# EAGLE design RPiDuino_revA (EAGLE 6.4)
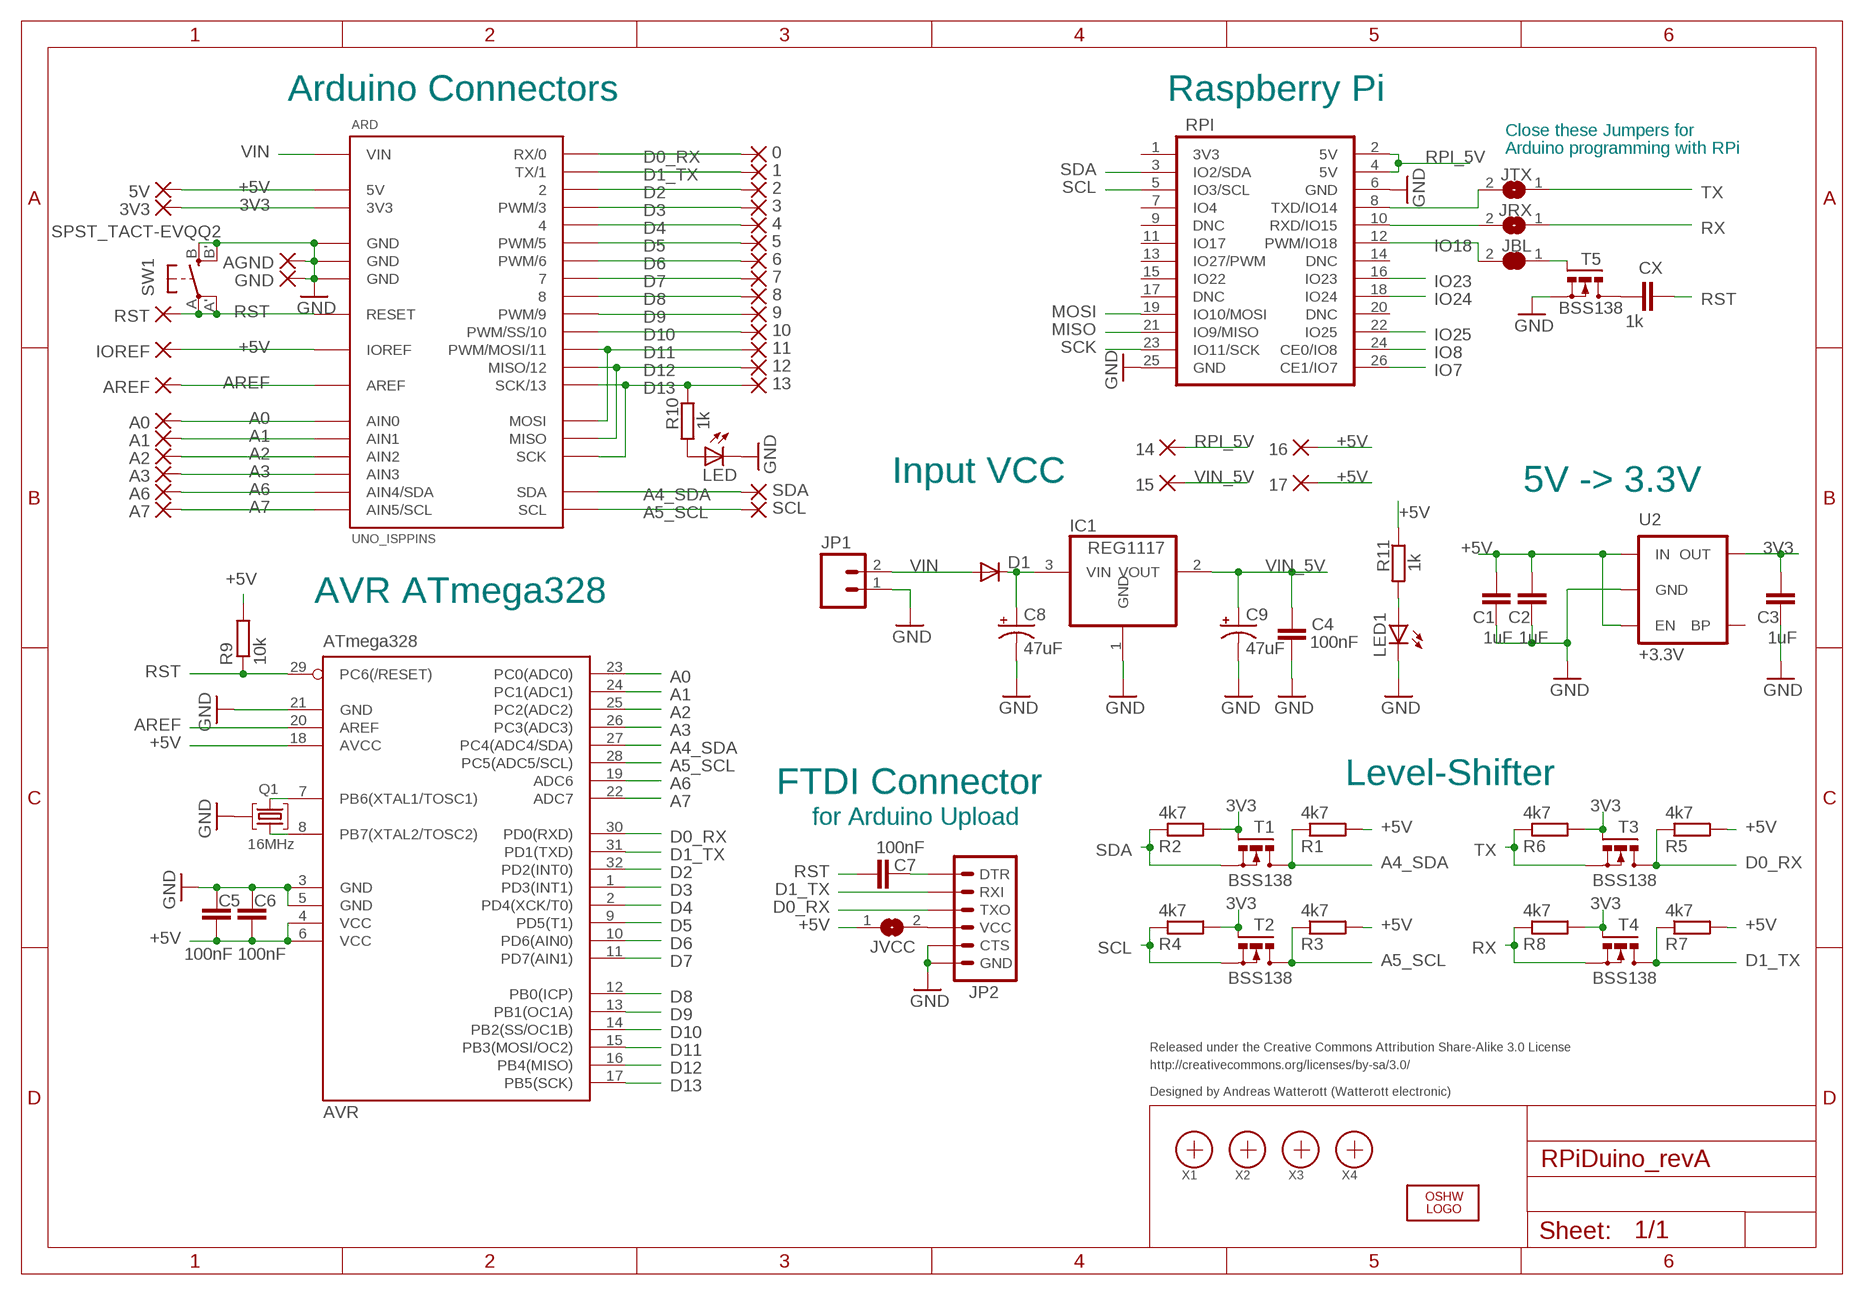
[diagram p0: schematic, sheet 1]

## Parts
0  WIREPAD1,6/0,9  [1,6/0,9]
1  WIREPAD1,6/0,9  [1,6/0,9]
2  WIREPAD1,6/0,9  [1,6/0,9]
3  WIREPAD1,6/0,9  [1,6/0,9]
3V3  WIREPAD1,6/0,9  [1,6/0,9]
4  WIREPAD1,6/0,9  [1,6/0,9]
5  WIREPAD1,6/0,9  [1,6/0,9]
5V  WIREPAD1,6/0,9  [1,6/0,9]
6  WIREPAD1,6/0,9  [1,6/0,9]
7  WIREPAD1,6/0,9  [1,6/0,9]
8  WIREPAD1,6/0,9  [1,6/0,9]
9  WIREPAD1,6/0,9  [1,6/0,9]
10  WIREPAD1,6/0,9  [1,6/0,9]
11  WIREPAD1,6/0,9  [1,6/0,9]
12  WIREPAD1,6/0,9  [1,6/0,9]
13  WIREPAD1,6/0,9  [1,6/0,9]
14  WIREPAD1,6/0,9  [1,6/0,9]
15  WIREPAD1,6/0,9  [1,6/0,9]
16  WIREPAD1,6/0,9  [1,6/0,9]
17  WIREPAD1,6/0,9  [1,6/0,9]
A0  WIREPAD1,6/0,9  [1,6/0,9]
A1  WIREPAD1,6/0,9  [1,6/0,9]
A2  WIREPAD1,6/0,9  [1,6/0,9]
A3  WIREPAD1,6/0,9  [1,6/0,9]
A6  WIREPAD1,6/0,9  [1,6/0,9]
A7  WIREPAD1,6/0,9  [1,6/0,9]
AGND  WIREPAD1,6/0,9  [1,6/0,9]
ARD  UNO_ISPPINS  [UNO_ISP3]
AREF  WIREPAD1,6/0,9  [1,6/0,9]
AVR  ATmega328  MEGA8-AI  [TQFP32-08]
C1  1uF  C-EUC0603  [C0603]
C2  1uF  C-EUC0603  [C0603]
C3  1uF  C-EUC0603  [C0603]
C4  100nF  C-EUC0603  [C0603]
C5  100nF  C-EUC0603  [C0603]
C6  100nF  C-EUC0603  [C0603]
C7  100nF  C-EUC0603  [C0603]
C8  47uF  CAP_POLD  [PANASONIC_D]
C9  47uF  CAP_POLD  [PANASONIC_D]
CX  1k  C-EUC0603  [C0603]
D1  DIODESMA  [SMA-DIODE]
GND  WIREPAD1,6/0,9  [1,6/0,9]
IC1  REG1117  [SOT223]
IOREF  WIREPAD1,6/0,9  [1,6/0,9]
JBL  SJ  [SJ]
JP1  M02PTH  [1X02]
JP2  ARDUINO_SERIAL_PROGRAMPTH  [1X06]
JRX  SJ  [SJ]
JTX  SJ  [SJ]
JVCC  SJ  [SJ]
LED  LEDCHIPLED_0603  [CHIPLED_0603]
LED1  LEDCHIPLED_0603  [CHIPLED_0603]
LOGO1  OSHW_LOGO_6MILX0150-NT  [OSHW_6X150_NOTEXT]
Q1  16MHz  SMD_OSC2  [SMD_OSC_35X15]
R1  4k7  R-EU_R0603  [R0603]
R2  4k7  R-EU_R0603  [R0603]
R3  4k7  R-EU_R0603  [R0603]
R4  4k7  R-EU_R0603  [R0603]
R5  4k7  R-EU_R0603  [R0603]
R6  4k7  R-EU_R0603  [R0603]
R7  4k7  R-EU_R0603  [R0603]
R8  4k7  R-EU_R0603  [R0603]
R9  10k  R-EU_R0603  [R0603]
R10  1k  R-EU_R0603  [R0603]
R11  1k  R-EU_R0603  [R0603]
RPI  RPI  [RPI]
RST  WIREPAD1,6/0,9  [1,6/0,9]
SCL  WIREPAD1,6/0,9  [1,6/0,9]
SDA  WIREPAD1,6/0,9  [1,6/0,9]
SW1  SPST_TACT-EVQQ2  [EVQ-Q2]
T1  BSS138  IRLML2502  [MICRO3]
T2  BSS138  IRLML2502  [MICRO3]
T3  BSS138  IRLML2502  [MICRO3]
T4  BSS138  IRLML2502  [MICRO3]
T5  BSS138  IRLML2502  [MICRO3]
U2  MIC52053.3V  [SOT23-5]
X1  PASSER  [PASSER]
X2  PASSER  [PASSER]
X3  PASSER  [PASSER]
X4  PASSER  [PASSER]

## Nets
3V3: 3V3.1(P) ARD.3V3 C3.1 R2.2 R4.2 R6.2 R8.2 T1.1(G) T2.1(G) T3.1(G) T4.1(G) U2.5(OUT)
+5V: 5V.1(P) 16.1(P) 17.1(P) ARD.5V ARD.IOREF AVR.4(VCC) AVR.6(VCC) AVR.18(AVCC) C1.1 C2.1 C5.1 C6.1 IOREF.1(P) JVCC.1 R1.2 R3.2 R5.2 R7.2 R9.2 R11.1 U2.1(IN) U2.3(EN)
A0: A0.1(P) ARD.AIN0 AVR.23(PC0(ADC0))
A1: A1.1(P) ARD.AIN1 AVR.24(PC1(ADC1))
A2: A2.1(P) ARD.AIN2 AVR.25(PC2(ADC2))
A3: A3.1(P) ARD.AIN3 AVR.26(PC3(ADC3))
A4_SDA: ARD.SDA AVR.27(PC4(ADC4/SDA)) R1.1 SDA.1(P) T1.3(D)
A5_SCL: ARD.SCL AVR.28(PC5(ADC5/SCL)) R3.1 SCL.1(P) T2.3(D)
A6: A6.1(P) ARD.AIN4(AIN4/SDA) AVR.19(ADC6)
A7: A7.1(P) ARD.AIN5(AIN5/SCL) AVR.22(ADC7)
AREF: ARD.AREF AREF.1(P) AVR.20(AREF)
D0_RX: 0.1(P) ARD.0(RX/0) AVR.30(PD0(RXD)) JP2.3(TXO) R5.1 T3.3(D)
D1_TX: 1.1(P) ARD.1(TX/1) AVR.31(PD1(TXD)) JP2.2(RXI) R7.1 T4.3(D)
D2: 2.1(P) ARD.2 AVR.32(PD2(INT0))
D3: 3.1(P) ARD.3(PWM/3) AVR.1(PD3(INT1))
D4: 4.1(P) ARD.4 AVR.2(PD4(XCK/T0))
D5: 5.1(P) ARD.5(PWM/5) AVR.9(PD5(T1))
D6: 6.1(P) ARD.6(PWM/6) AVR.10(PD6(AIN0))
D7: 7.1(P) ARD.7 AVR.11(PD7(AIN1))
D8: 8.1(P) ARD.8 AVR.12(PB0(ICP))
D9: 9.1(P) ARD.9(PWM/9) AVR.13(PB1(OC1A))
D10: 10.1(P) ARD.10(PWM/SS/10) AVR.14(PB2(SS/OC1B))
D11: 11.1(P) ARD.11(PWM/MOSI/11) ARD.MOSI AVR.15(PB3(MOSI/OC2))
D12: 12.1(P) ARD.12(MISO/12) ARD.MISO AVR.16(PB4(MISO))
D13: 13.1(P) ARD.13(SCK/13) ARD.SCK AVR.17(PB5(SCK)) R10.1
DTR: C7.1 JP2.1(DTR)
GND: AGND.1(P) ARD.GND@1(GND) ARD.GND@2(GND) ARD.GND@3(GND) AVR.3(GND) AVR.5(GND) AVR.21(GND) C1.2 C2.2 C3.2 C4.2 C5.2 C6.2 C8.- C9.- GND.1(P) IC1.1(GND) JP1.1 JP2.5(CTS) JP2.6(GND) LED1.C LED.C Q1.GND RPI.6(GND) RPI.25(GND) SW1.B'(S1) SW1.B(S) T5.2(S) U2.2(GND)
IO7: RPI.26(CE1/IO7)
IO8: RPI.24(CE0/IO8)
IO18: JBL.2 RPI.12(PWM/IO18)
IO23: RPI.16(IO23)
IO24: RPI.18(IO24)
IO25: RPI.22(IO25)
MISO: RPI.21(IO9/MISO)
MOSI: RPI.19(IO10/MOSI)
N$1: AVR.8(PB7(XTAL2/TOSC2)) Q1.2
N$2: AVR.7(PB6(XTAL1/TOSC1)) Q1.1
N$3: LED1.A R11.2
N$4: C8.+ D1.C IC1.3(VIN)
N$5: JP2.4(VCC) JVCC.2
N$11: CX.1 T5.3(D)
N$12: LED.A R10.2
RPI_5V: 14.1(P) RPI.2(5V) RPI.4(5V)
RPI_RST: JBL.1 T5.1(G)
RST: ARD.RST(RESET) AVR.29(PC6(/RESET)) C7.2 CX.2 R9.1 RST.1(P) SW1.A'(P1) SW1.A(P)
RX: JRX.1 R8.1 T4.2(S)
RX_IO15: JRX.2 RPI.10(RXD/IO15)
SCK: RPI.23(IO11/SCK)
SCL: R4.1 RPI.5(IO3/SCL) T2.2(S)
SDA: R2.1 RPI.3(IO2/SDA) T1.2(S)
TX: JTX.1 R6.1 T3.2(S)
TX_IO14: JTX.2 RPI.8(TXD/IO14)
VIN: ARD.VIN D1.A JP1.2
VIN_5V: 15.1(P) C4.1 C9.+ IC1.2(VOUT)
Unconnected: RPI.1(3V3) RPI.7(IO4) RPI.9(DNC) RPI.11(IO17) RPI.13(IO27/PWM) RPI.14(DNC) RPI.15(IO22) RPI.17(DNC) RPI.20(DNC) U2.4(BP)

## Notes on the sheet
- Arduino Connectors | Raspberry Pi
- Close these Jumpers for
- Arduino programming with RPi
- Input VCC | 5V -> 3.3V
- AVR ATmega328
- +3.3V
- FTDI Connector | Level-Shifter
- for Arduino Upload
- Released under the Creative Commons Attribution Share-Alike 3.0 License
- http://creativecommons.org/licenses/by-sa/3.0/
- Designed by Andreas Watterott (Watterott electronic)

## Library data of the parts
0 1-3 3V3 4 5 5V 6-17 A0 A1-A3 A6 A7 AGND AREF GND IOREF RST SCL SDA = wirepad:WIREPAD: Wire PAD connect wire on PCB
ARD = Arduino:UNO_ISP: Arduino UNO
AVR = atmel:MEGA8: MICROCONTROLLER 8 Kbytes FLASH, 1 kbytes SRAM, 512 bytes EEPROM, USART, 6-channel 10 bit ADC, 2-channel 8 bit ADC Pin compatible with Atmega48, ATMega88, ATMega168 Source: avr.lbr; MPN: ATMEGA8-16AU; OC_FARNELL: 9171371; OC_NEWARK: 73M8863
C1-C7 CX = rcl:C-EU: CAPACITOR, European symbol
C8 C9 = SparkFun-Capacitors:CAP_POL: Capacitor Polarized These are standard SMD and PTH capacitors. Normally 10uF, 47uF, and 100uF in electrolytic and tantalum varieties. Always verify the external diameter of the through hole cap, it varies with capacity, voltage, and manufacturer. The EIA devices should be standard.
D1 = SparkFun-DiscreteSemi:DIODE: Diode These are standard reverse protection diodes and small signal diodes. SMA package can handle up to about 1A. SOD-323 can handle about 200mA. What the SOD-323 package when ordering, there are some mfgs out there that are 5-pin packages.
IC1 = burr-brown:REG1117: 800mA and 1A Low Dropout (LDO) Positive Regulator 1.8V, 2.5V, 2.85V, 3.3V, 5V, and Adj; MPN: REG1117; OC_FARNELL: 1097566; OC_NEWARK: 14P6981
JBL JRX JTX JVCC = jumper:SJ: SMD solder JUMPER
JP1 = SparkFun-Connectors:M02: Header 2 Standard 2-pin 0.1" header. Use with straight break away headers (SKU : PRT-00116), right angle break away headers (PRT-00553), swiss pins (PRT-00743), machine pins (PRT-00117), and female headers (PRT-00115). Molex polarized connector foot print use with SKU : PRT-08233 with associated crimp pins and housings.
JP2 = SparkFun-Connectors:ARDUINO_SERIAL_PROGRAM: FTDI connector footprints
LED LED1 = led:LED: LED OSRAM: - CHIPLED LG R971, LG N971, LY N971, LG Q971, LY Q971, LO R971, LY R971 LH N974, LH R974 LS Q976, LO Q976, LY Q976 LO Q996 - Hyper CHIPLED LW Q18S LB Q993, LB Q99A, LB R99A - SideLED LS A670, LO A670, LY A670, LG A670, LP A670 LB A673, LV A673, LT A673, LW A673 LH A674 LY A675 LS A676, LA A676, LO A676, LY A676, LW A676 LS A679, LY A679, LG A679 - Hyper Micro SIDELED® LS Y876, LA Y876, LO Y876, LY Y876 LT Y87S - SmartLED LW L88C, LW L88S LB L89C, LB L89S, LG L890 LS L89K, LO L89K, LY L89K LS L896, LA L896, LO L896, LY L896 - TOPLED LS T670, LO T670, LY T670, LG T670, LP T670 LSG T670, LSP T670, LSY T670, LOP T670, LYG T670 LG T671, LOG T671, LSG T671 LB T673, LV T673, LT T673, LW T673 LH T674 LS T676, LA T676, LO T676, LY T676, LB T676, LH T676, LSB T676, LW T676 LB T67C, LV T67C, LT T67C, LS T67K, LO T67K, LY T67K, LW E67C LS E67B, LA E67B, LO E67B, LY E67B, LB E67C, LV E67C, LT E67C LW T67C LS T679, LY T679, LG T679 LS T770, LO T770, LY T770, LG T770, LP T770 LB T773, LV T773, LT T773, LW T773 LH T774 LS E675, LA E675, LY E675, LS T675 LS T776, LA T776, LO T776, LY T776, LB T776 LHGB T686 LT T68C, LB T68C - Hyper Mini TOPLED® LB M676 - Mini TOPLED Santana® LG M470 LS M47K, LO M47K, LY M47K Source: http://www.osram.convergy.de LUXEON: - LUMILED® LXK2-PW12-R00, LXK2-PW12-S00, LXK2-PW14-U00, LXK2-PW14-V00 LXK2-PM12-R00, LXK2-PM12-S00, LXK2-PM14-U00 LXK2-PE12-Q00, LXK2-PE12-R00, LXK2-PE12-S00, LXK2-PE14-T00, LXK2-PE14-U00 LXK2-PB12-K00, LXK2-PB12-L00, LXK2-PB12-M00, LXK2-PB14-N00, LXK2-PB14-P00, LXK2-PB14-Q00 LXK2-PR12-L00, LXK2-PR12-M00, LXK2-PR14-Q00, LXK2-PR14-R00 LXK2-PD12-Q00, LXK2-PD12-R00, LXK2-PD12-S00 LXK2-PH12-R00, LXK2-PH12-S00 LXK2-PL12-P00, LXK2-PL12-Q00, LXK2-PL12-R00 Source: www.luxeon.com KINGBRIGHT: KA-3528ASYC Source: www.kingbright.com
LOGO1 = OSHW:OSHW_LOGO_6MIL
Q1 = Crystal:SMD_OSC
R1-R11 = rcl:R-EU_: RESISTOR, European symbol
RPI = RaspberryPi:RPI; OC_FARNELL: unknown; OC_NEWARK: unknown
SW1 = adafruit:SPST_TACT: SMT 6mm switch, EVQQ2 series http://www.ladyada.net/library/eagle
T1-T5 = IRF-sot23:IRLML2502: N-Channel Power MOSFET
U2 = SparkFun-PowerIC:MIC5205: MIC5205 150mA vreg 3.3V - VREG-00822 5V - VREG-00823; PROD_ID: VREG-00822
X1-X4 = SMD:PASSER

## Board
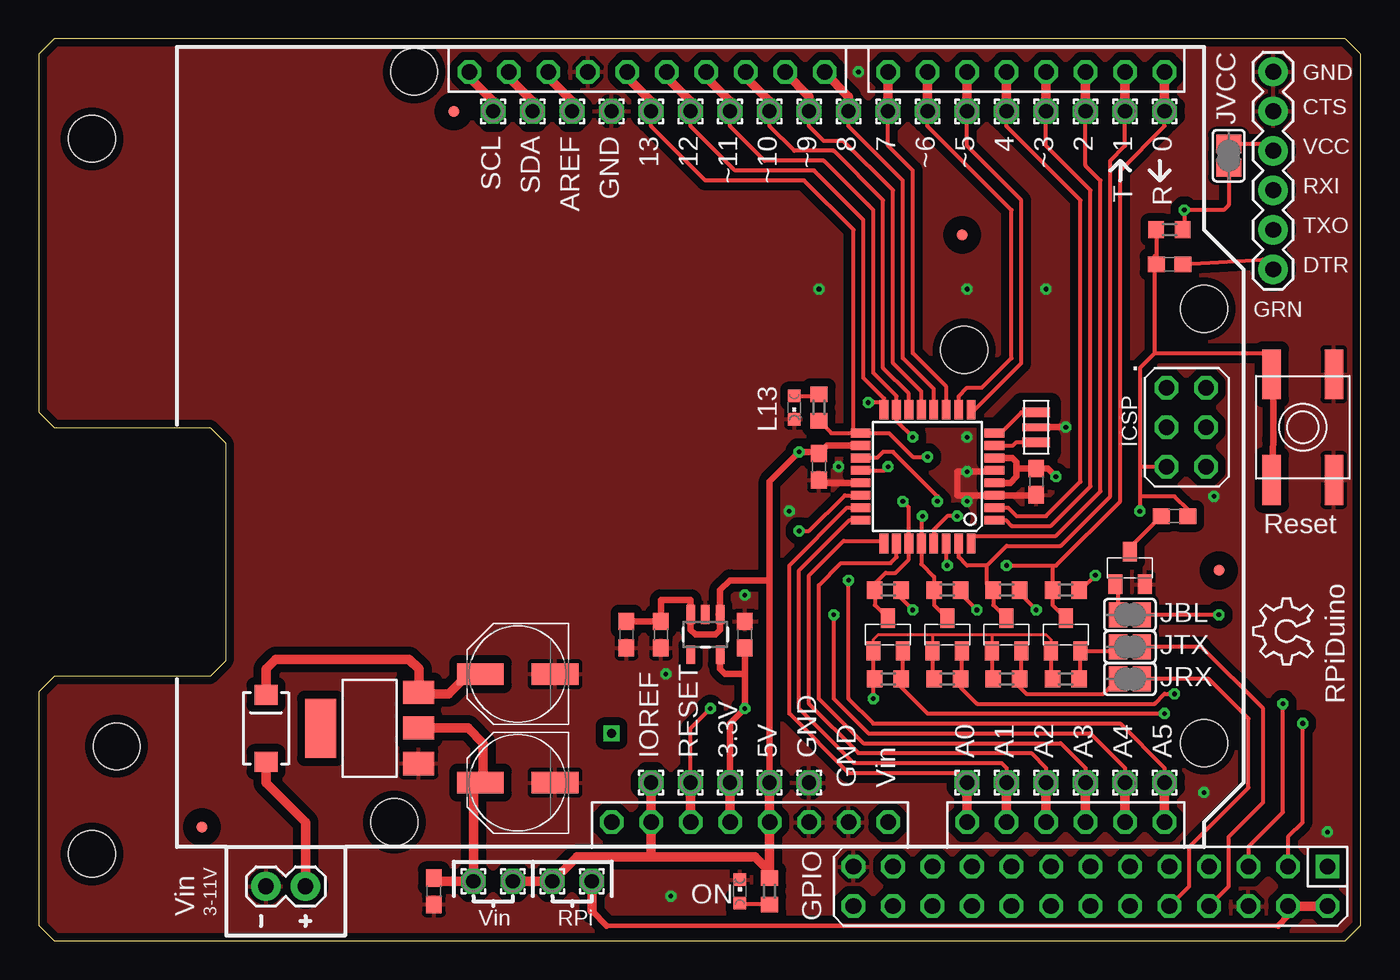
[diagram p1: board, top side]
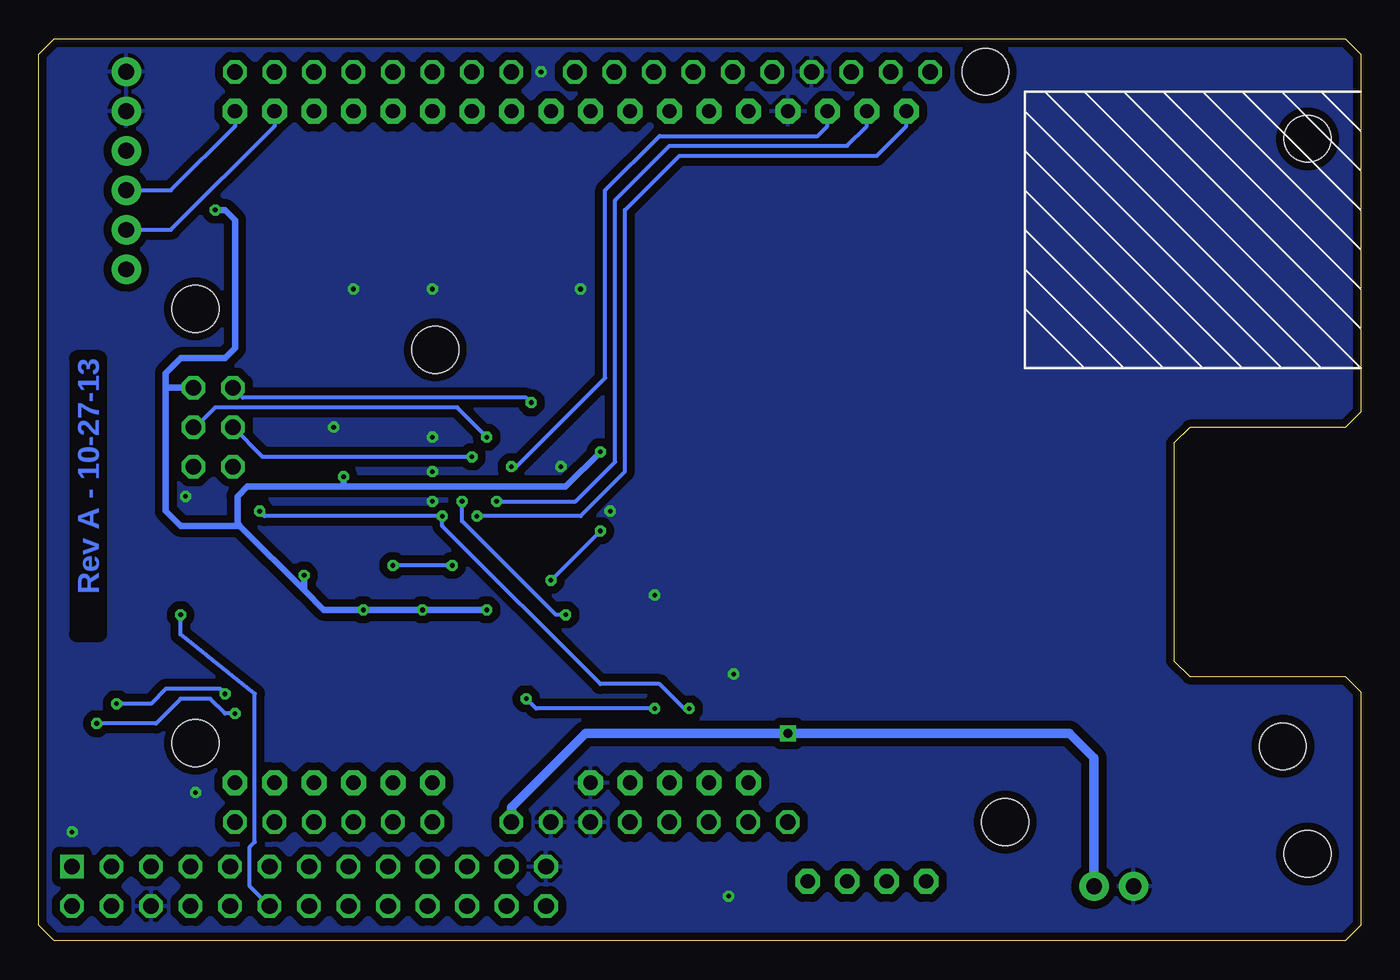
[diagram p2: board, bottom side, seen from below]

Size 85 x 58 mm. Coordinates in mm from the lower left corner, seen from the top.
Outline: 1,0 84,0 85,1 85,57 84,58 1,58 0,57 0,34 1,33 11,33 12,32 12,18 11,17 1,17 0,16 0,1 1,0
Copper layers (1*16): Top 0.035mm / dielectric 1.5mm / Bottom 0.035mm
Design rules "default *": minimum track width 8mil, minimum drill 0.3mm, track to track 8mil, track to pad 8mil, pad to pad 8mil, via to via 8mil, smd to smd 8mil, copper to edge 20mil, drill to drill 8mil, minimum pad ring 10mil, minimum via ring 8mil, stop-mask expansion 4mil, vias tented up to drill 0.5mm, thermal gap 10mil
Holes 3 mm at 5,12.5 59.5,38 3.41,5.58 3.41,51.58
tRestrict: area 61,31.4 to 65.1,34.6

### Footprints (pad centres in the part's own frame; a part is rotated, then mirrored left to right if it is on the bottom)
1,6/0,9 = drill 0.914 pad 1.6 octagon: 1 0,0
UNO_ISP3 = drill 1 octagon: 0 63.5,50.8; 1 60.96,50.8; 2 58.42,50.8; 3 55.88,50.8; 3V3 35.56,2.54; 4 53.34,50.8; 5 50.8,50.8; 5V 38.1,2.54; 6 48.26,50.8; 7 45.72,50.8; 8 41.656,50.8; 9 39.116,50.8; 10 36.576,50.8; 11 34.036,50.8; 12 31.496,50.8; 13 28.956,50.8; AIN0 50.8,2.54; AIN1 53.34,2.54; AIN2 55.88,2.54; AIN3 58.42,2.54; AIN4 60.96,2.54; AIN5 63.5,2.54; AREF 23.876,50.8; GND@1 40.64,2.54; GND@2 43.18,2.54; GND@3 26.416,50.8; GND@4 66.167,25.4; IOREF 30.48,2.54; MISO 63.627,30.48; MOSI 66.167,27.94; NC 27.94,2.54; RST 33.02,2.54; RST2 63.627,25.4; SCK 63.627,27.94; SCL 18.796,50.8; SDA 21.336,50.8; VCC 66.167,30.48; VIN 45.72,2.54 | hole 3: 66.04,35.56; 66.04,7.62; 15.24,50.8; 13.97,2.54
TQFP32-08 = smd 1.27 x 0.559: 1 -4.293,2.8; 2 -4.293,2; 3 -4.293,1.2; 4 -4.293,0.4; 5 -4.293,-0.4; 6 -4.293,-1.2; 7 -4.293,-2; 8 -4.293,-2.8; 17 4.293,-2.8; 18 4.293,-2; 19 4.293,-1.2; 20 4.293,-0.4; 21 4.293,0.4; 22 4.293,1.2; 23 4.293,2; 24 4.293,2.8 | smd 0.559 x 1.27: 9 -2.8,-4.293; 10 -2,-4.293; 11 -1.2,-4.293; 12 -0.4,-4.293; 13 0.4,-4.293; 14 1.2,-4.293; 15 2,-4.293; 16 2.8,-4.293; 25 2.8,4.293; 26 2,4.293; 27 1.2,4.293; 28 0.4,4.293; 29 -0.4,4.293; 30 -1.2,4.293; 31 -2,4.293; 32 -2.8,4.293
C0603 = smd 1.1 x 1: 1 -0.85,0; 2 0.85,0
PANASONIC_D = smd 3 x 1.4: + 2.4,0; - -2.4,0
SMA-DIODE = smd 1.27 x 1.47: A -2.15,0; C 2.15,0
SOT223 = smd 1.499 x 2.007: 1 -2.261,-3.15; 2 0.025,-3.15; 3 2.311,-3.15 | smd 3.81 x 2.007: 4 0,3.15
SJ = smd 1.168 x 1.6: 1 -0.762,0; 2 0.762,0
1X02 = drill 1.016 pad 1.88: 1 0,0; 2 2.54,0
1X06 = drill 1.016 pad 1.88: 1 0,0; 2 2.54,0; 3 5.08,0; 4 7.62,0; 5 10.16,0; 6 12.7,0
CHIPLED_0603 = smd 0.8 x 0.8: A 0,-0.75; C 0,0.75
SMD_OSC_35X15 = smd 0.635 x 1.778: 1 -0.965,0; 2 0.965,0 | smd 0.508 x 1.778: GND 0,0
R0603 = smd 1 x 1.1: 1 -0.85,0; 2 0.85,0
RPI = drill 1.016 square: 1 -15.24,-1.27 | drill 1.016 octagon: 2 -15.24,1.27; 3 -12.7,-1.27; 4 -12.7,1.27; 5 -10.16,-1.27; 6 -10.16,1.27; 7 -7.62,-1.27; 8 -7.62,1.27; 9 -5.08,-1.27; 10 -5.08,1.27; 11 -2.54,-1.27; 12 -2.54,1.27; 13 0,-1.27; 14 0,1.27; 15 2.54,-1.27; 16 2.54,1.27; 17 5.08,-1.27; 18 5.08,1.27; 19 7.62,-1.27; 20 7.62,1.27; 21 10.16,-1.27; 22 10.16,1.27; 23 12.7,-1.27; 24 12.7,1.27; 25 15.24,-1.27; 26 15.24,1.27
EVQ-Q2 = smd 3.2 x 1.2: A -3.4,-2; A' 3.4,-2; B -3.4,2; B' 3.4,2
MICRO3 = smd 0.9 x 1.25: 1 -0.95,-1.05; 2 0.95,-1.05; 3 0,1.05
SOT23-5 = smd 0.55 x 1.2: 1 -0.95,-1.3; 2 0,-1.3; 3 0.95,-1.3; 4 0.95,1.3; 5 -0.95,1.3
PASSER = smd 0.7 x 0.7: X 0,0

### Placement (x,y rotation side)
0  72.39,53.34 0 top
1  69.85,53.34 0 top
2  67.31,53.34 0 top
3  64.77,53.34 0 top
3V3  44.45,10.16 90 top
4  62.23,53.34 0 top
5  59.69,53.34 0 top
5V  46.99,10.16 90 top
6  57.15,53.34 0 top
7  54.61,53.34 0 top
8  52.07,53.34 0 top
9  49.53,53.34 0 top
10  46.99,53.34 0 top
11  44.45,53.34 0 top
12  41.91,53.34 0 top
13  39.37,53.34 0 top
14  35.56,3.81 0 top
15  27.94,3.81 0 top
16  30.48,3.81 0 top
17  33.02,3.81 0 top
A0  59.69,10.16 0 top
A1  62.23,10.16 0 top
A2  64.77,10.16 0 top
A3  67.31,10.16 0 top
A6  69.85,10.16 0 top
A7  72.39,10.16 0 top
AGND  36.83,53.34 0 top
ARD  8.89,5.08 0 top
AREF  34.29,53.34 0 top
AVR  57.15,29.84 180 top
C1  37.78,19.68 270 top
C2  40.01,19.68 270 top
C3  45.4,19.68 90 top
C4  25.4,3.17 270 top
C5  64.14,29.53 270 top
C6  50.16,30.48 270 top
C7  72.71,43.5 180 top
C8  30.8,17.14 180 top
C9  30.8,10.16 180 top
CX  73.03,27.3 0 top
D1  14.61,13.65 90 top
GND  49.53,10.16 0 top
IC1  21.27,13.65 90 top
IOREF  39.37,10.16 0 top
JBL  70.17,20.95 0 top
JP1  14.61,3.49 0 top
JP2  79.38,43.18 90 top
JRX  70.17,16.83 0 top
JTX  70.17,18.89 0 top
JVCC  76.52,50.48 90 top
LED  48.58,34.29 180 top
LED1  45.09,3.17 0 top
LOGO1  81.92,17.78 90 top
Q1  64.14,33.02 90 top
R1  54.61,22.54 0 top
R2  54.61,16.83 180 top
R3  58.42,22.54 0 top
R4  58.42,16.83 180 top
R5  66.04,22.54 0 top
R6  66.04,16.83 180 top
R7  62.23,22.54 0 top
R8  62.23,16.83 180 top
R9  72.71,45.72 0 top
R10  50.16,34.29 90 top
R11  46.99,3.17 270 top
RPI  67.63,3.49 180 top
RST  41.91,10.16 0 top
SCL  29.21,53.34 0 top
SDA  31.75,53.34 0 top
SW1  81.28,33.02 270 top
T1  54.61,19.68 0 top
T2  58.42,19.68 0 top
T3  66.04,19.68 0 top
T4  62.23,19.68 0 top
T5  70.17,23.97 0 top
U2  42.86,19.68 180 top
X1  10.48,7.3 0 top
X2  26.67,53.34 0 top
X3  59.37,45.4 0 top
X4  75.88,23.81 0 top

### Tracks (layer width: path | path; a pad name or v marks a point on that pad's centre or on a via)
3V3  (via drill 0.3)
  Top 0.203: 57.47,19.68 53.98,19.68 53.66,19.37 T1.1 | 57.47,19.68 61.28,19.68 | 61.28,19.68 64.77,19.68 65.09,19.37 T3.1 | 57.47,19.68 57.47,18.73 | 61.28,19.68 61.28,18.73
  Top 0.254: R4.2 57.47,16.93 T2.1 57.47,18.73 | R6.2 65.09,16.93 T3.1 | R8.2 61.28,16.93 T4.1 61.28,18.73 | T1.1 53.66,16.93 | 53.66,16.93 R2.2 | 53.66,16.93 v53.66,15.56
  Top 0.406: 3V3.1 44.45,13.97 v45.4,14.92 45.4,17.14 | U2.5 43.81,17.46 44.13,17.14 45.4,17.14 | C3.1 45.4,17.14
  Top 0.61: ARD.3V3 3V3.1
  Bottom 0.254: v53.66,15.56 53.02,14.92 v45.4,14.92
+5V  (via drill 0.3)
  Top 0.254: 50.06,31.43 C6.1 | 62.97,30.38 62.87,30.48 | R1.2 55.46,22.01 v56.2,21.27 | R3.2 59.27,22.33 v60.33,21.27 | R7.2 63.08,22.33 v64.14,21.27 | R5.2 66.99,22.54 v67.94,23.5 | R9.2 73.66,45.82 v73.66,46.99 76.2,46.99 76.52,47.31 JVCC.1
  Top 0.406: AVR.4 62.47,29.45 62.87,29.84 62.87,30.48 62.87,30.8 62.62,31.05 AVR.6 | AVR.18 50.68,31.84 C6.1 | 50.06,31.43 v48.9,31.43 46.99,29.53 46.99,23.18 | 62.97,30.38 C5.1 64.87,30.38 v65.41,29.84 | 5V.1 46.99,23.18 | U2.3 41.91,20 42.23,19.68 43.5,19.68 43.81,20 U2.1 | U2.3 | U2.3 41.91,21.91 40.01,21.91 C2.1 C1.1 | U2.1 43.81,22.54 44.45,23.18 46.99,23.18
  Top 0.61: 5V.1 ARD.5V R11.1 46.99,4.45 46.04,5.4 39.37,5.4 | U2.1 | 16.1 17.1 34.61,5.4 39.37,5.4 | IOREF.1 ARD.IOREF 39.37,5.4
  Bottom 0.406: 65.41,29.21 v65.41,29.84 | 65.41,29.21 51.12,29.21 v48.9,31.43 | v56.2,21.27 v60.33,21.27 v64.14,21.27 66.67,21.27 67.94,22.54 | 65.41,29.21 71.6,29.21 72.23,28.57 72.23,26.83 72.07,26.67 | 72.07,26.67 67.94,22.54 | 67.94,22.54 v67.94,23.5 | 72.07,26.67 75.88,26.67 76.83,27.62 76.83,35.56 | v73.66,46.99 73.03,46.99 72.39,46.35 72.39,38.1 73.03,37.47 75.88,37.47 76.83,36.51 76.83,35.56 | 76.83,35.56 75.25,35.56
A0
  Top 0.254: AVR.23 51.98,27.84 48.26,24.13 48.26,14.61 52.07,10.79 59.05,10.79 A0.1
  Top 0.61: A0.1 ARD.AIN0
A1
  Top 0.254: AVR.24 52.13,27.05 48.9,23.81 48.9,14.92 52.39,11.43 61.91,11.43 62.23,11.11 A1.1
  Top 0.61: A1.1 ARD.AIN1
A2
  Top 0.254: AVR.25 54.19,25.72 51.75,25.72 49.53,23.5 49.53,15.24 52.7,12.06 63.82,12.06 64.77,11.11 A2.1
  Top 0.61: A2.1 ARD.AIN2
A3
  Top 0.254: AVR.26 55.15,24.67 54.77,24.29 51.59,24.29 50.16,22.86 50.16,15.56 53.02,12.7 65.72,12.7 67.31,11.11 A3.1
  Top 0.61: A3.1 ARD.AIN3
A4_SDA  (via drill 0.3)
  Top 0.254: T1.3 53.76,21.59 R1.1 53.76,22.96 54.45,23.65 55.09,23.65 55.95,24.52 AVR.27 55.95,27.87 v55.56,28.26
  Top 0.61: ARD.SDA 30.23,55.5 31.75,53.98 SDA.1
  Bottom 0.254: SDA.1 31.75,52.39 33.02,51.12 44.45,51.12 47.94,47.62 47.94,30.8 50.48,28.26 v55.56,28.26
A5_SCL  (via drill 0.3)
  Top 0.254: T2.3 57.57,21.59 R3.1 57.57,23.39 56.75,24.21 AVR.28 56.75,27.22 v56.83,27.3
  Top 0.61: ARD.SCL 27.69,55.5 29.21,53.98 SCL.1
  Bottom 0.254: SCL.1 29.21,52.39 31.11,50.48 43.81,50.48 47.31,46.99 47.31,30.16 50.16,27.3 v56.83,27.3
A6  (via drill 0.3)
  Top 0.254: v51.12,20.95 51.12,15.56 53.34,13.34 67.63,13.34 69.85,11.11 A6.1 | AVR.19 53.91,31.05 54.29,31.43 54.93,31.43 57.78,28.57 v57.78,28.26
  Top 0.61: A6.1 ARD.AIN4
  Bottom 0.254: v51.12,20.95 51.75,20.95 57.78,26.99 v57.78,28.26
A7  (via drill 0.3)
  Top 0.254: v52.07,23.18 52.07,15.56 53.66,13.97 69.53,13.97 72.39,11.11 A7.1 | AVR.22 51.82,28.64 49.53,26.35 v48.9,26.35
  Top 0.61: A7.1 ARD.AIN5
  Bottom 0.254: v52.07,23.18 v48.9,26.35
AREF  (via drill 0.3)
  Top 0.254: AVR.20 54.38,30.25 v54.61,30.48
  Top 0.61: ARD.AREF 32.77,55.5 34.29,53.98 AREF.1
  Bottom 0.254: AREF.1 34.29,52.39 34.92,51.75 45.09,51.75 48.58,48.26 48.58,36.2 54.29,30.48 v54.61,30.48
D0_RX  (via drill 0.3)
  Top 0.254: T3.3 65.19,21.59 R5.1 65.19,24.03 65.09,24.13 | 0.1 72.39,52.39 69.53,49.53 69.53,28.26 65.41,24.13 65.09,24.13 | AVR.30 58.35,24.2 v58.42,24.13 | v62.23,24.13 65.09,24.13
  Top 0.61: 0.1 ARD.0
  Bottom 0.254: v58.42,24.13 v62.23,24.13 | 0.1 72.39,52.39 76.52,48.26 JP2.3
D1_TX
  Top 0.254: T4.3 61.38,21.59 R7.1 60.96,22.96 60.96,24.13 | AVR.31 59.15,24.67 59.69,24.13 60.96,24.13 | 60.96,24.13 62.23,25.4 65.72,25.4 68.9,28.57 68.9,50.16 69.85,51.12 1.1
  Top 0.61: 1.1 ARD.1
  Bottom 0.254: 1.1 69.85,52.39 76.52,45.72 JP2.2
D2
  Top 0.254: AVR.32 59.95,25.98 60.01,26.04 65.41,26.04 68.26,28.89 68.26,48.9 67.31,49.85 2.1
  Top 0.61: 2.1 ARD.2
D3
  Top 0.254: AVR.1 62.17,27.05 62.55,26.67 65.09,26.67 67.63,29.21 67.63,48.26 64.77,51.12 3.1
  Top 0.61: 3.1 ARD.3
D4
  Top 0.254: AVR.2 62.33,27.84 62.87,27.3 64.77,27.3 66.99,29.53 66.99,47.62 62.23,52.39 4.1
  Top 0.61: 4.1 ARD.4
D5
  Top 0.254: AVR.9 59.95,33.91 63.18,37.15 63.18,47.62 59.69,51.12 5.1
  Top 0.61: 5.1 ARD.5
D6
  Top 0.254: AVR.10 59.15,35.02 59.69,35.56 60.64,35.56 62.55,37.47 62.55,46.99 57.15,52.39 6.1
  Top 0.61: 6.1 ARD.6
D7
  Top 0.254: AVR.11 58.35,35.63 56.2,37.78 56.2,49.53 54.61,51.12 7.1
  Top 0.61: 7.1 ARD.7
D8
  Top 0.254: AVR.12 57.55,35.48 55.56,37.47 55.56,48.9 52.07,52.39 8.1 | 50.55,55.82 ARD.8
  Top 0.61: 50.55,55.82 52.07,54.29 8.1
D9
  Top 0.254: AVR.13 56.75,35.33 54.93,37.15 54.93,48.26 51.75,51.44 50.48,51.44 49.53,52.39 9.1 | 48.01,55.82 ARD.9
  Top 0.61: 48.01,55.82 49.53,54.29 9.1
D10
  Top 0.254: AVR.14 55.95,35.17 54.29,36.83 54.29,47.62 51.12,50.8 48.58,50.8 46.99,52.39 10.1
  Top 0.61: ARD.10 45.47,55.5 46.99,53.98 10.1
D11  (via drill 0.3)
  Top 0.254: 11.1 44.45,52.39 46.67,50.16 50.48,50.16 53.66,46.99 53.66,36.51 55.15,35.02 AVR.15 55.15,33.43 v56.2,32.38
  Top 0.61: ARD.11 42.93,55.5 44.45,53.98 11.1
  Bottom 0.254: ARD.MOSI 74.93,33.02 73.66,34.29 58.1,34.29 v56.2,32.38
D12  (via drill 0.3)
  Top 0.254: AVR.16 54.35,34.66 | 54.35,34.66 54.35,34.87 53.02,36.2 53.02,46.35 49.85,49.53 44.77,49.53 41.91,52.39 12.1 | 54.35,34.66 54.29,34.61 v53.34,34.61
  Top 0.61: ARD.12 40.39,55.5 41.91,53.98 12.1
  Bottom 0.254: v53.34,34.61 53.66,34.92 71.88,34.92 ARD.MISO
D13  (via drill 0.3)
  Top 0.254: R10.1 50.96,32.65 AVR.17 | 13.1 39.37,52.39 42.86,48.9 49.21,48.9 52.39,45.72 52.39,32.7 52.45,32.65 AVR.17 | AVR.17 54.67,32.65 56.2,31.11 v57.15,31.11
  Top 0.61: ARD.13 37.85,55.5 39.37,53.98 13.1
  Bottom 0.254: v57.15,31.11 70.61,31.11 ARD.SCK
DTR
  Top 0.254: C7.1 78.74,43.81 JP2.1
GND  (via drill 0.3)
  Top 0.406: C5.2 64.14,28.64 AVR.3 59.05,28.64 59.05,30.16 61.44,30.16 AVR.5 | v66.04,33.02 Q1.GND | AVR.21 50.16,29.45 C6.2
  other vias: 40.32,17.14 45.4,22.23 59.69,30.16 51.44,30.48 59.69,28.26 59.69,32.38 50.16,41.91 48.26,27.62 64.77,41.91 59.69,41.91 75.56,28.57 74.93,9.53 52.7,55.88 40.64,2.86 82.87,6.99
  pour Top (isolate 0.508): -0.64,-0.64 85.64,-0.64 85.64,58.32 -0.64,58.32
  pour Bottom (isolate 0.508): 0,0 85,0 85,58 0,58
IO18  (via drill 0.3)
  Top 0.254: v75.88,20.95 JBL.2
  Bottom 0.254: RPI.12 71.44,3.49 71.44,6.03 71.12,6.35 71.12,15.88 75.88,19.68 v75.88,20.95
N$1
  Top 0.254: AVR.8 61.85,32.65 63.18,33.97 64.12,33.97 Q1.2
N$2
  Top 0.254: AVR.7 62.64,31.84 62.87,32.07 64.12,32.07 Q1.1
N$3
  Top 0.254: 47.09,2.33 45.19,2.33 LED1.A
  Top 0.61: R11.2 47.09,2.33
N$4
  Top 0.61: D1.C 14.61,17.46 15.24,18.1 23.81,18.1 24.45,17.46 24.45,15.99 IC1.3 24.51,15.88 26.35,15.88 27.62,17.14 C8.+
N$5
  Top 0.254: JVCC.2 78.93,51.24 JP2.4
N$11
  Top 0.254: T5.3 70.17,25.3 CX.1
N$12
  Top 0.254: LED.A 50.16,35.04 R10.2
RPI_5V
  Top 0.305: 79.69,0.95 36.51,0.95
  Top 0.406: RPI.4 80.33,1.59 79.69,0.95 | 36.51,0.95 35.56,1.91
  Top 0.61: RPI.2 RPI.4 | 35.56,1.91 14.1
RPI_RST
  Top 0.254: JBL.1 69.41,22.73 T5.1
RST  (via drill 0.3)
  Top 0.254: AVR.29 57.55,26.43 58.42,27.3 v59.05,27.3 | RST.1 41.91,13.65 v43.18,14.92 | 71.75,37.78 70.8,36.83 70.8,30.48 | CX.2 73.88,27.73 73.03,28.57 70.8,28.57 | 71.75,37.78 71.75,44.03 C7.2 R9.1 | 71.75,37.78 79.38,37.78 | 70.8,30.48 70.8,28.57 | 70.8,28.57 v70.8,27.62 | 70.8,30.48 72.39,30.48
  Top 0.406: SW1.A 79.28,36.29 79.38,36.2 | 79.38,37.78 79.38,36.2 | 79.38,36.2 79.38,32.26 SW1.A'
  Top 0.61: ARD.RST RST.1
  Bottom 0.254: v70.8,27.62 70.48,27.3 v59.05,27.3 59.05,26.67 48.9,16.51 45.09,16.51 43.5,14.92 v43.18,14.92
RX
  Top 0.254: T4.2 63.18,16.93 R8.1 63.08,16.3 63.5,15.88 68.45,15.88 JRX.1
RX_IO15
  Top 0.254: RPI.10 73.98,3.49 73.98,6.03 77.79,9.84 77.79,14.29 75.25,16.83 JRX.2
SCL  (via drill 0.3)
  Top 0.254: T2.2 59.37,16.93 R4.1 59.27,16.3 60.33,15.24 71.75,15.24 72.39,15.88 v73.03,15.88 | RPI.5 77.79,6.03 80.01,8.26 v80.01,15.24
  Bottom 0.254: v73.03,15.88 73.34,16.19 76.83,16.19 77.79,15.24 v80.01,15.24
SDA  (via drill 0.3)
  Top 0.254: T1.2 55.56,16.93 R2.1 55.46,16.3 57.15,14.61 v72.39,14.61 | RPI.3 80.33,6.67 81.28,7.62 v81.28,13.97
  Bottom 0.254: v72.39,14.61 73.03,14.61 73.98,15.56 75.88,15.56 77.47,13.97 v81.28,13.97
TX
  Top 0.254: R6.1 66.99,16.93 T3.2 69.15,18.64 JTX.1
TX_IO14
  Top 0.254: RPI.8 76.52,3.49 76.52,6.67 78.74,8.89 78.74,14.92 74.77,18.89 JTX.2
VIN  (via drill 0.6)
  Top 0.61: D1.A 14.61,10.16 17.14,7.62 JP1.2
  Bottom 0.61: ARD.VIN 54.61,8.57 49.85,13.34 v36.83,13.34 18.73,13.34 17.14,11.75 JP1.2
VIN_5V
  Top 0.61: IC1.2 27.6,13.68 28.57,12.7 28.57,10.34 C9.+ 27.94,9.7 15.1 25.61,3.81 C4.1

### Text on the board
Bottom: Rev A - 10-27-13
tPlace: GND | CTS | SCL | SDA | AREF | GND | 13 | 12 | ~11 | ~10 | ~9 | 8 | 7 | ~6 | ~5 | 4 | ~3 | 2 | 1 | 0 | VCC | T | R | RXI | TXO | DTR | GRN | . | L13 | ICSP | Reset | RPiDuino | IOREF | RESET | 3.3V | 5V | GND | A0 | A1 | A2 | A3 | A4 | A5 | GND | Vin | Vin | 3-11V | ON | Vin | RPi | GPIO